# EAGLE schematic DorMouse-V1.0 (EAGLE 6.3)
Swallow r1
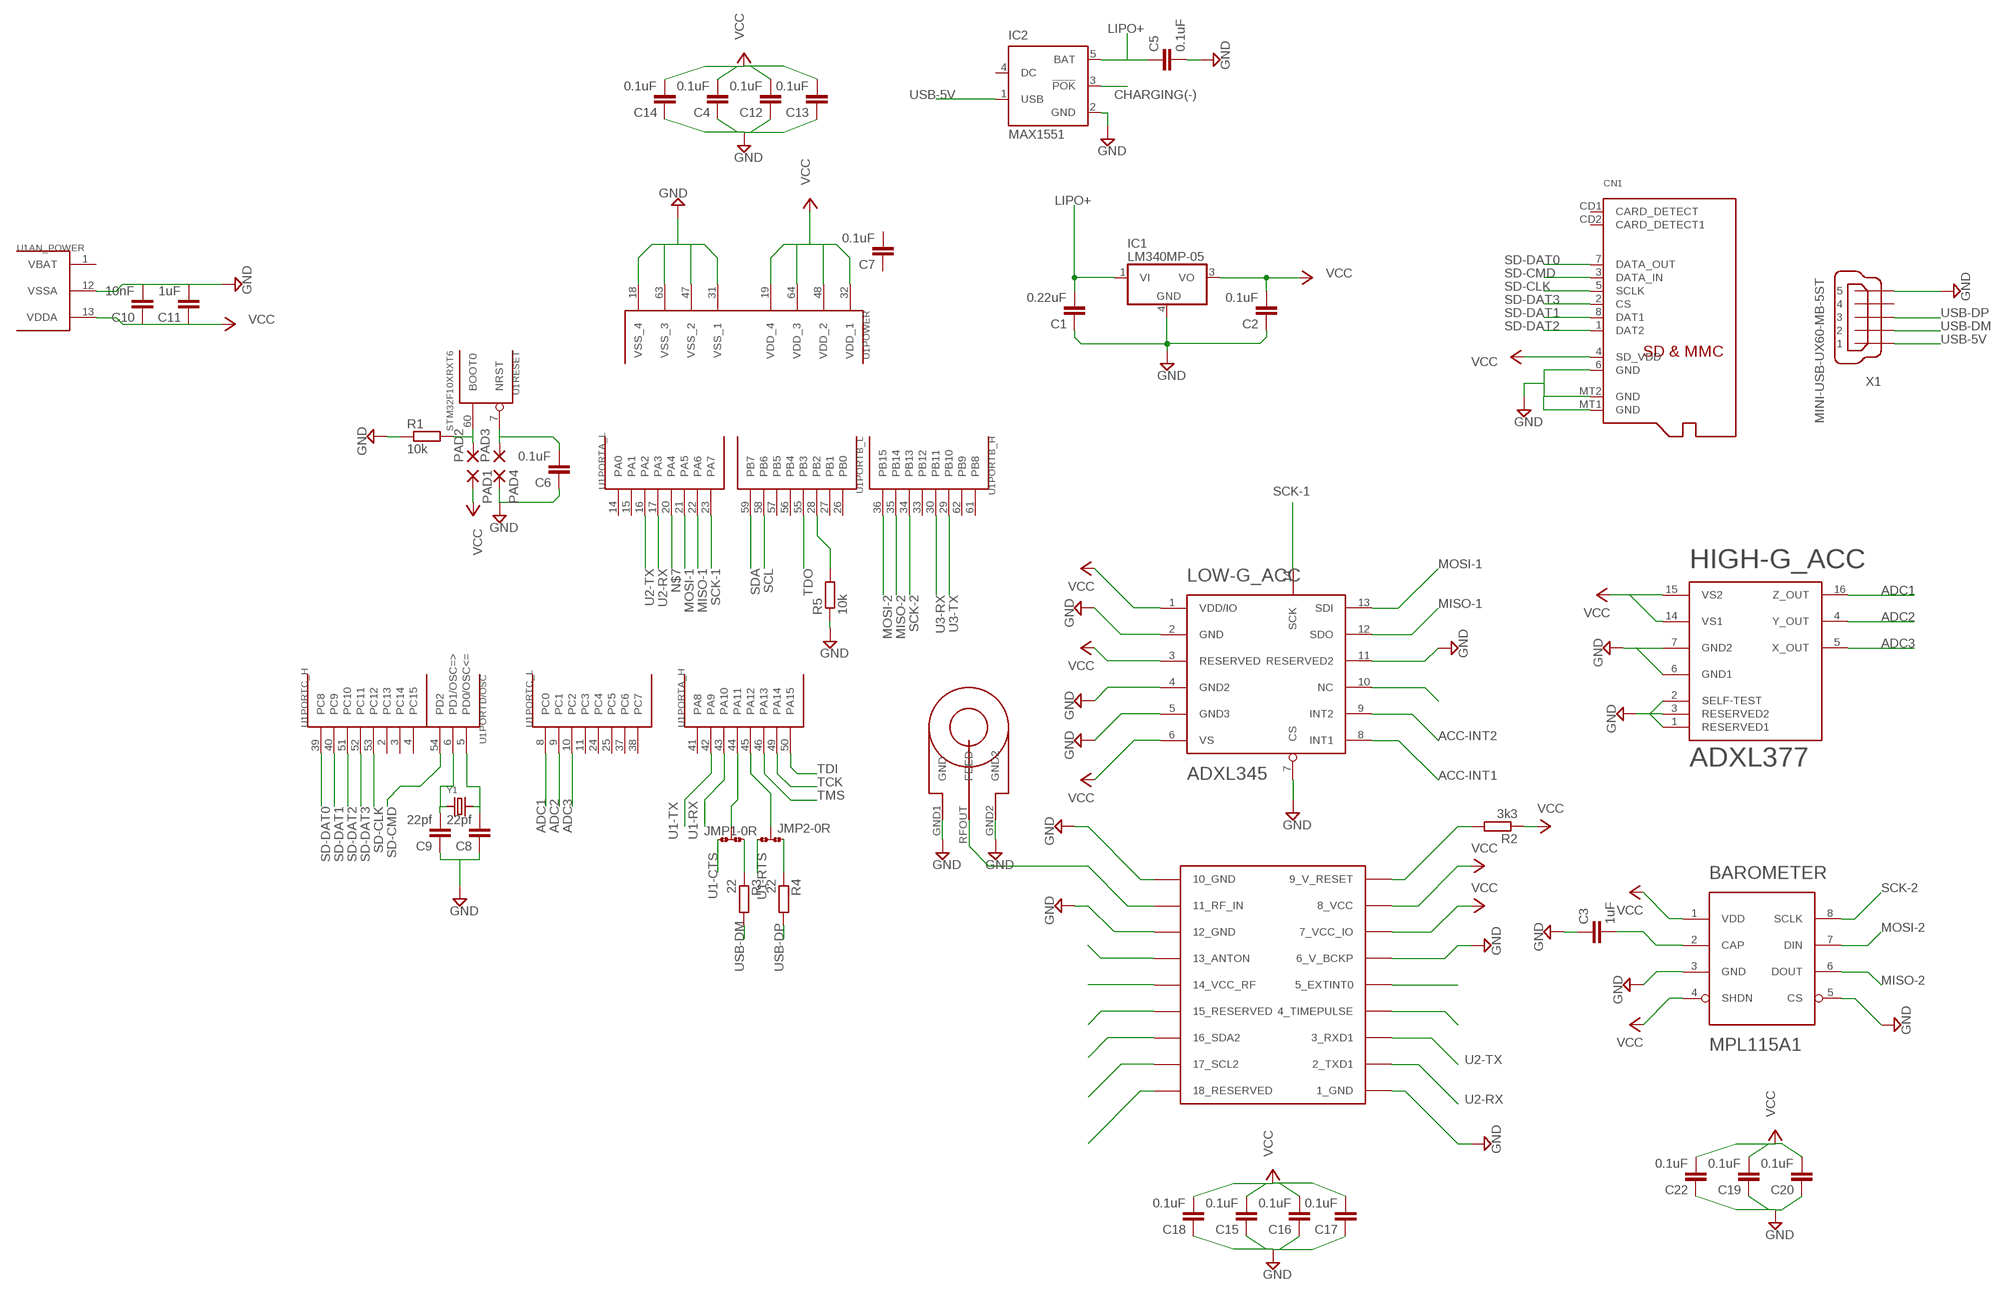
[diagram p0: schematic, sheet 1, part 1 of 2]
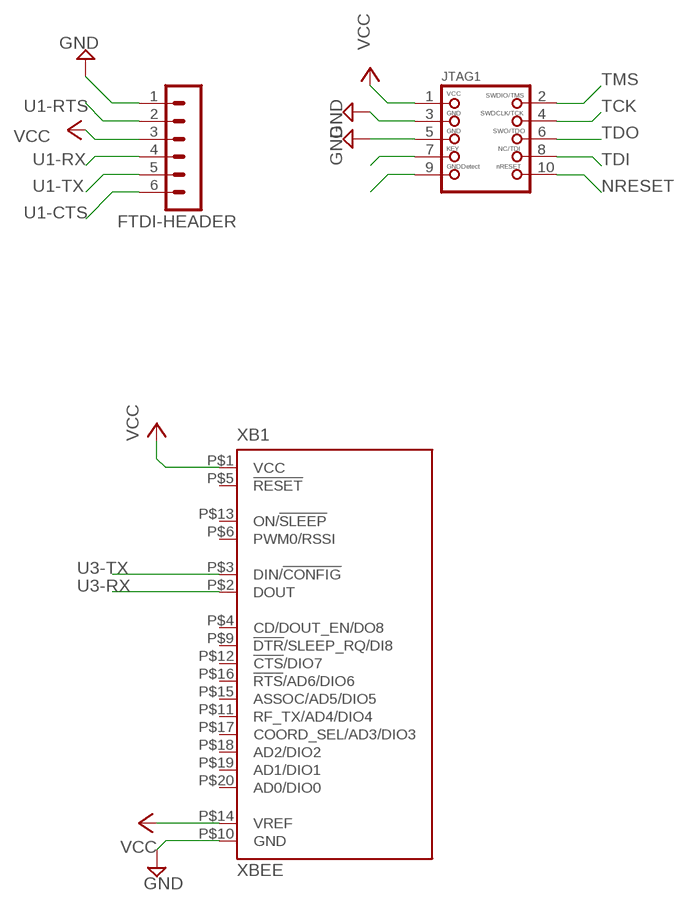
[diagram p1: schematic, sheet 1, part 2 of 2]

## Parts
BAROMETER  MPL115A1  [LGA-8]
C1  0.22uF  C-EUC0402  [C0402]
C2  0.1uF  C-EUC0402  [C0402]
C3  1uF  C-EUC0402  [C0402]
C4  0.1uF  C-EUC0402  [C0402]
C5  0.1uF  C-EUC0402  [C0402]
C6  0.1uF  C-EUC0402  [C0402]
C7  0.1uF  C-EUC0402  [C0402]
C8  22pf  C-EUC0402  [C0402]
C9  22pf  C-EUC0402  [C0402]
C10  10nF  C-EUC0402  [C0402]
C11  1uF  C-EUC0402  [C0402]
C12  0.1uF  C-EUC0402  [C0402]
C13  0.1uF  C-EUC0402  [C0402]
C14  0.1uF  C-EUC0402  [C0402]
C15  0.1uF  C-EUC0402  [C0402]
C16  0.1uF  C-EUC0402  [C0402]
C17  0.1uF  C-EUC0402  [C0402]
C18  0.1uF  C-EUC0402  [C0402]
C19  0.1uF  C-EUC0402  [C0402]
C20  0.1uF  C-EUC0402  [C0402]
C22  0.1uF  C-EUC0402  [C0402]
CN1  MICROSD  [MICROSD]
FTDI-HEADER  MA06-1  [MA06-1]
GPS  UBLOX_MAX-6  [UBLOX_MAX-6]
HIGH-G_ACC  ADXL377  [LFCSP-16]
IC1  LM340MP-05  [SOT223]
IC2  MAX1551  [SOT23-5L]
JMP1  0R-JUMPA  [A0R-JMP]
JMP2  0R-JUMPA  [A0R-JMP]
JTAG1  JTAG-CORTEXM3  [2X05_1.27MM_SMT]
LOW-G_ACC  ADXL345  [LGA-14]
PAD1  SMD2  [SMD1,27-2,54]
PAD2  SMD2  [SMD1,27-2,54]
PAD3  SMD2  [SMD1,27-2,54]
PAD4  SMD2  [SMD1,27-2,54]
R1  10k  R-EU_R0402  [R0402]
R2  3k3  R-EU_R0402  [R0402]
R3  22  R-EU_R0402  [R0402]
R4  22  R-EU_R0402  [R0402]
R5  10k  R-EU_R0402  [R0402]
U1  STM32F10XRXT6  [TQFP64]
U$1  SARANTEL-SL1204  [SARANTEL-SL1204]
X1  MINI-USB-UX60-MB-5ST  [UX60-MB-5ST]
XB1  XBEE  [XBEE]
Y1  CRYSTALSMD  [HC49UP]

## Nets
ACC-INT1: LOW-G_ACC.8(INT1)
ACC-INT2: LOW-G_ACC.9(INT2)
ADC1: HIGH-G_ACC.16(Z_OUT) U1.8(PORTC_L:PC0)
ADC2: HIGH-G_ACC.4(Y_OUT) U1.9(PORTC_L:PC1)
ADC3: HIGH-G_ACC.5(X_OUT) U1.10(PORTC_L:PC2)
AVR-INT0: GPS.4_TIMEPULSE
BOOT1: R5.2 U1.28(PORTB_L:PB2)
CHARGING(-): IC2.3(!POK)
GND: BAROMETER.3(GND) BAROMETER.5(CS) C1.1 C2.1 C3.1 C4.1 C5.2 C6.1 C8.1 C9.1 C10.2 C11.2 C12.1 C13.1 C14.1 C15.1 C16.1 C17.1 C18.1 C19.1 C20.1 C22.1 CN1.6(GND) CN1.MT1(GND) CN1.MT2(GND) FTDI-HEADER.1 GPS.1_GND GPS.6_V_BCKP GPS.10_GND GPS.12_GND HIGH-G_ACC.1(RESERVED1) HIGH-G_ACC.2(SELF-TEST) HIGH-G_ACC.3(RESERVED2) HIGH-G_ACC.6(GND1) HIGH-G_ACC.7(GND2) IC1.4(GND) IC2.2(GND) JTAG1.3 JTAG1.5 LOW-G_ACC.2(GND) LOW-G_ACC.4(GND2) LOW-G_ACC.5(GND3) LOW-G_ACC.7(CS) LOW-G_ACC.11(RESERVED2) PAD4.1(P) R1.1 R5.1 U1.12(AN_POWER:VSSA) U1.18(POWER:VSS_4) U1.31(POWER:VSS_1) U1.47(POWER:VSS_2) U1.63(POWER:VSS_3) U$1.GND1(GND) U$1.GND2 X1.5 XB1.P$10(GND)
LIPO+: C1.2 C5.1 IC1.1(VI) IC2.5(BAT)
MISO-1: LOW-G_ACC.12(SDO) U1.22(PORTA_L:PA6)
MISO-2: BAROMETER.6(DOUT) U1.35(PORTB_H:PB14)
MOSI-1: LOW-G_ACC.13(SDI) U1.21(PORTA_L:PA5)
MOSI-2: BAROMETER.7(DIN) U1.36(PORTB_H:PB15)
N$1: GPS.16_SDA2
N$2: PAD2.1(P) R1.2 U1.60(RESET:BOOT0)
N$3: BAROMETER.2(CAP) C3.2
N$4: GPS.5_EXTINT0
N$5: JMP1.2 U1.44(PORTA_H:PA11)
N$6: C9.2 U1.6(PORTD/OSC:PD1/OSC=>) Y1.1
N$7: U1.20(PORTA_L:PA4)
N$8: JMP2.2 U1.45(PORTA_H:PA12)
N$9: C6.2 PAD3.1(P) U1.7(RESET:NRST)
N$10: GPS.17_SCL2
N$11: LOW-G_ACC.10(NC)
N$12: JMP1.3 R3.1
N$13: JMP2.3 R4.1
N$14: C8.2 U1.5(PORTD/OSC:PD0/OSC<=) Y1.2
N$15: GPS.9_V_RESET R2.2
N$16: GPS.13_ANTON
N$18: GPS.11_RF_IN U$1.RFOUT(FEED)
N$20: GPS.15_RESERVED
N$22: JTAG1.7
N$23: GPS.18_RESERVED
N$24: GPS.14_VCC_RF
N$25: JTAG1.9
NRESET: JTAG1.10
SCK-1: LOW-G_ACC.14(SCK) U1.23(PORTA_L:PA7)
SCK-2: BAROMETER.8(SCLK) U1.34(PORTB_H:PB13)
SCL: U1.58(PORTB_L:PB6)
SD-CLK: CN1.5(SCLK) U1.53(PORTC_H:PC12)
SD-CMD: CN1.3(DATA_IN) U1.54(PORTD/OSC:PD2)
SD-DAT0: CN1.7(DATA_OUT) U1.39(PORTC_H:PC8)
SD-DAT1: CN1.8(DAT1) U1.40(PORTC_H:PC9)
SD-DAT2: CN1.1(DAT2) U1.51(PORTC_H:PC10)
SD-DAT3: CN1.2(CS) U1.52(PORTC_H:PC11)
SDA: U1.59(PORTB_L:PB7)
TCK: JTAG1.4 U1.49(PORTA_H:PA14)
TDI: JTAG1.8 U1.50(PORTA_H:PA15)
TDO: JTAG1.6 U1.55(PORTB_L:PB3)
TMS: JTAG1.2 U1.46(PORTA_H:PA13)
U1-CTS: FTDI-HEADER.6 JMP1.1
U1-RTS: FTDI-HEADER.2 JMP2.1
U1-RX: FTDI-HEADER.4 U1.43(PORTA_H:PA10)
U1-TX: FTDI-HEADER.5 U1.42(PORTA_H:PA9)
U2-RX: GPS.2_TXD1 U1.17(PORTA_L:PA3)
U2-TX: GPS.3_RXD1 U1.16(PORTA_L:PA2)
U3-RX: U1.30(PORTB_H:PB11) XB1.P$2(DOUT)
U3-TX: U1.29(PORTB_H:PB10) XB1.P$3(DIN/!CONFIG)
USB-5V: IC2.1(USB) X1.1
USB-DM: R3.2 X1.2
USB-DP: R4.2 X1.3
VCC: BAROMETER.1(VDD) BAROMETER.4(SHDN) C2.2 C4.2 C10.1 C11.1 C12.2 C13.2 C14.2 C15.2 C16.2 C17.2 C18.2 C19.2 C20.2 C22.2 CN1.4(SD_VDD) FTDI-HEADER.3 GPS.7_VCC_IO GPS.8_VCC HIGH-G_ACC.14(VS1) HIGH-G_ACC.15(VS2) IC1.3(VO) JTAG1.1 LOW-G_ACC.1(VDD/IO) LOW-G_ACC.3(RESERVED) LOW-G_ACC.6(VS) PAD1.1(P) R2.1 U1.13(AN_POWER:VDDA) U1.19(POWER:VDD_4) U1.32(POWER:VDD_1) U1.48(POWER:VDD_2) U1.64(POWER:VDD_3) XB1.P$1(VCC) XB1.P$14(VREF)
Unconnected: C7.1 C7.2 CN1.CD1(CARD_DETECT) CN1.CD2(CARD_DETECT1) IC2.4(DC) U1.2(PORTC_H:PC13) U1.3(PORTC_H:PC14) U1.4(PORTC_H:PC15) U1.11(PORTC_L:PC3) U1.14(PORTA_L:PA0) U1.15(PORTA_L:PA1) U1.24(PORTC_L:PC4) U1.25(PORTC_L:PC5) U1.26(PORTB_L:PB0) U1.27(PORTB_L:PB1) U1.33(PORTB_H:PB12) U1.37(PORTC_L:PC6) U1.38(PORTC_L:PC7) U1.41(PORTA_H:PA8) U1.56(PORTB_L:PB4) U1.57(PORTB_L:PB5) U1.61(PORTB_H:PB8) U1.62(PORTB_H:PB9) X1.4 XB1.P$4(CD/DOUT_EN/DO8) XB1.P$5(!RESET) XB1.P$6(PWM0/RSSI) XB1.P$9(!DTR!/SLEEP_RQ/DI8) XB1.P$11(RF_TX/AD4/DIO4) XB1.P$12(!CTS!/DIO7) XB1.P$13(ON/!SLEEP) XB1.P$15(ASSOC/AD5/DIO5) XB1.P$16(!RTS!/AD6/DIO6) XB1.P$17(COORD_SEL/AD3/DIO3) XB1.P$18(AD2/DIO2) XB1.P$19(AD1/DIO1) XB1.P$20(AD0/DIO0)

## Power pins joined to a net without a drawn wire
VBAT: U1.1(AN_POWER:VBAT)

## Library data of the parts
BAROMETER = DorMouse:MPL115A1
C1-C20 C22 = rcl:C-EU: CAPACITOR, European symbol
CN1 = microbuilder:MICROSD: MicroSD/Transflash Card Holder with SPI pinout 3M: 2908-05WB-MG 4UConnector: 19656 Footprint courtesy: Adafruit Industries
FTDI-HEADER = con-lstb:MA06-1: PIN HEADER; OC_FARNELL: unknown; OC_NEWARK: unknown
GPS = DorMouse:UBLOX_MAX-6: UBLOX MAX-6
HIGH-G_ACC = DorMouse:ADXL377
IC1 = linear:LM340?-*: Positive VOLTAGE REGULATOR Source: http://cache.national.com/ds/LM/LM340.pdf
IC2 = maxim:MAX1551: Dual-Input USB/AC Adapter 1-Cell Li+ Battery Chargers Source: http://www.maxim-ic.com .. MAX1551-MAX1555.pdf; MF: MAXIM; MPN: MAX1551EZK-T; OC_FARNELL: 1628221; OC_NEWARK: 88H0599
JMP1 JMP2 = jump-0r-smd:0R-JUMP: SMD 0R 0805 Jumper
JTAG1 = microbuilder:JTAG-CORTEXM3: Serial Wire (SW-DP) Connector This standard 0.05" 10-pin connector is for use with the Cortex M0/M3's native SWD (serial wire debugger) interface (SW-DP). Some boards support a 20-pin combined JTAG+SWD connector (SWJ-DP), such as the LPC1700 family, but many smaller devices only work with SWD which typically use the smaller 10-pin SW-DP connecter (the LPC1300 family, for example, only supports SWD). 2x05 1.27mm/0.05" Connector: This is the standard SMT connector defined by ARM for all Cortex devices, and should be used in most situations and for forward-compatibility since any new devices coming to market will likely use this connector. MOLEX 10 Pin 0.1" Connector: This 0.1" 10 pin connector has the same pin layout as the standard 0.05" connector, but is easier to work with if you are using standard jumper wires or custom cables to connect your SWD hardware. MOLEX 20 Pin 0.1" Connector: This 0.1" 20 pin connector is the same model used for ARM7/ARM9 JTAG debuggers, but is connected to match the pins on the Segger J-Link for ARM (which supports both JTAG and SWD debugging). See the following document from ARM for more information on Cortex M3 Debug Connectors: http://infocenter.arm.com/help/topic/com.arm.doc.faqs/attached/13634/cortex_debug_connectors.pdf And the following page for an overview with images of the different connector types: http://www.keil.com/peripherals/coresight/connectors.asp
LOW-G_ACC = DorMouse:ADXL345
PAD1-PAD4 = wirepad:SMD2: SMD PAD
R1-R5 = rcl:R-EU_: RESISTOR, European symbol
U1 = stm32:STM32F10XRXT6: STM32F101/103 64pin LQFP
U$1 = Swallow:SARANTEL-SL1204: SARANTEL - SL1204SB - ANTENNA, GPS, GEOHELIX
X1 = con-hirose:MINI-USB-: MINI USB Connector Source: http://www.hirose.co.jp/cataloge_hp/e24000019.pdf; OC_FARNELL: unknown; OC_NEWARK: unknown
XB1 = DorMouse:XBEE: XBee (TM) /XBee-PRO(TM) OEM RF Modules Source: MaxStream, Inc. xbee_productmanual.pdf; MPN: XBP24-Z7UIT-004; OC_FARNELL: 1751799; OC_NEWARK: 34R5507
Y1 = microbuilder:CRYSTAL: Crystals HC49UP - Surface Mount Crystal 4.0MHz 18pF +/-30ppm Surface Mount Crystal [Digikey: 535-9857-1-ND] 12.0 MHz Surface Mount Crystal [Digikey: 535-9869-6-ND] 25.0 MHz Surface Mount Crystal [Digikey: 535-9078-1-ND] 2.5 x 2.0mm - MEMs SMT Crystal 16.0 MHz 10pF 20ppm 2.5 x 2.0mm Crystal [Digikey -40-85°C: 535-10923-1-ND] 3.2 x 2.5mm - MEMs SMT Crystal 12.0 MHz 8pF 15ppm 3.2 x 2.5mm Crystal [Digikey: -10-70°C: 644-1047-1-ND -40-125°C: 644-1128-1-ND] 16.0 MHz 8pF 15ppm 3.2 x 2.5mm Crystal [Digikey: -10-70°C: 644-1049-1-ND -40-125°C: 644-1129-2-ND] 16.0 MHz 10pF 10ppm 3.2 x 2.5mm Crystal [Digikey: 644-1100-1-ND] 27.12 MHz 18pF 30ppm 3.2 x 2.5mm Crystal [Digikey: 887-1424-1-ND] 27.12MHz 10pF 10ppm 3.2 x 2.5mm Crystal [Digikey: 887-1329-1-ND] 4.9 x 1.8mm - MEMs SMT Crystal 32.768 KHz 12.5pF 20ppm 4.9 x 1.8mm Crystal [Digikey: SE2415CT-ND] 8.0 x 3.8mm - Surface Mount Crystal 32.768kHz 12.5pF 20ppm -40°C-85°C [Digikey: 535-9166-2-ND] Cylinder 32.768KHz Cylinder Crystal (2x6mm body) [Ex. Digikey: 300-8341-2-ND]